# EAGLE design V1 (EAGLE 9.2.2)
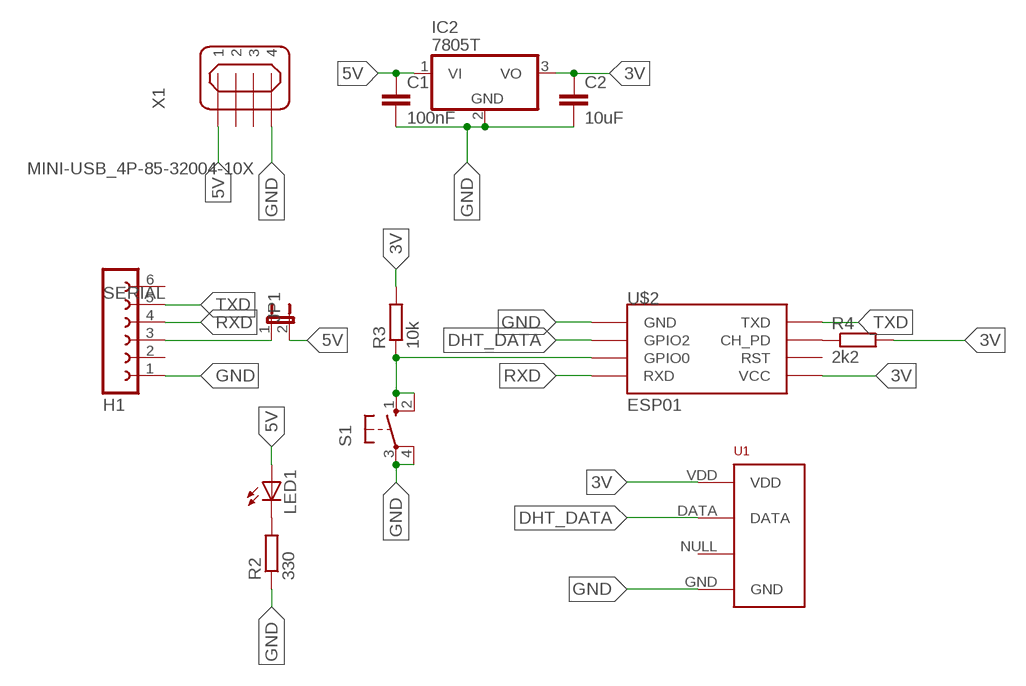
[diagram p0: schematic, sheet 1]

## Parts
C1  100nF  C-EU025-030X050  [C025-030X050]
C2  10uF  C-EU025-030X050  [C025-030X050]
IC2  7805T  [TO220H]
JP1  JP1E  [JP1]
LED1  LED5MM  [LED5MM]
R2  330  R-EU_0207/10  [0207/10]
R3  10k  R-EU_0207/10  [0207/10]
R4  2k2  R-EU_0207/10  [0207/10]
S1  10-XX  [B3F-10XX]
SERIAL  H1  FE06-1  [FE06]
U1  RHT03_DHT-22_AM2302  [RHT03_DHT-22]
U$2  ESP01  [ESP01]
X1  MINI-USB_4P-85-32004-10X  [85-32004-10X]

## Nets
3V: C2.1 IC2.3(VO) R3.2 R4.2 U1.VDD U$2.VCC
5V: C1.1 IC2.1(VI) JP1.2 LED1.A X1.1
DHT_DATA: U1.DATA U$2.GPIO2
GND: C1.2 C2.2 IC2.2(GND) R2.1 S1.3(P) S1.4(P1) SERIAL.1 U1.GND U$2.GND X1.4
N$1: JP1.1 SERIAL.3
N$2: LED1.K(C) R2.2
N$3: R3.1 S1.1(S) S1.2(S1) U$2.GPIO0
N$4: R4.1 U$2.CH_PD
RXD: SERIAL.4 U$2.RX(RXD)
TXD: SERIAL.5 U$2.TX(TXD)
Unconnected: SERIAL.2 SERIAL.6 U1.NULL U$2.RST X1.2 X1.3

## Library data of the parts
C1 C2 = rcl:C-EU: CAPACITOR, European symbol; SPICEPREFIX: C
IC2 = linear:78*: Positive VOLTAGE REGULATOR Source: http://cache.national.com/ds/LM/LM78L05.pdf http://www.fairchildsemi.com/ds/LM/LM7805.pdf
JP1 = jumper:JP1E: JUMPER
LED1 = led:LED: LED OSRAM: - CHIPLED LG R971, LG N971, LY N971, LG Q971, LY Q971, LO R971, LY R971 LH N974, LH R974 LS Q976, LO Q976, LY Q976 LO Q996 - Hyper CHIPLED LW Q18S LB Q993, LB Q99A, LB R99A - SideLED LS A670, LO A670, LY A670, LG A670, LP A670 LB A673, LV A673, LT A673, LW A673 LH A674 LY A675 LS A676, LA A676, LO A676, LY A676, LW A676 LS A679, LY A679, LG A679 - Hyper Micro SIDELED® LS Y876, LA Y876, LO Y876, LY Y876 LT Y87S - SmartLED LW L88C, LW L88S LB L89C, LB L89S, LG L890 LS L89K, LO L89K, LY L89K LS L896, LA L896, LO L896, LY L896 - TOPLED LS T670, LO T670, LY T670, LG T670, LP T670 LSG T670, LSP T670, LSY T670, LOP T670, LYG T670 LG T671, LOG T671, LSG T671 LB T673, LV T673, LT T673, LW T673 LH T674 LS T676, LA T676, LO T676, LY T676, LB T676, LH T676, LSB T676, LW T676 LB T67C, LV T67C, LT T67C, LS T67K, LO T67K, LY T67K, LW E67C LS E67B, LA E67B, LO E67B, LY E67B, LB E67C, LV E67C, LT E67C LW T67C LS T679, LY T679, LG T679 LS T770, LO T770, LY T770, LG T770, LP T770 LB T773, LV T773, LT T773, LW T773 LH T774 LS E675, LA E675, LY E675, LS T675 LS T776, LA T776, LO T776, LY T776, LB T776 LHGB T686 LT T68C, LB T68C - Hyper Mini TOPLED® LB M676 - Mini TOPLED Santana® LG M470 LS M47K, LO M47K, LY M47K Source: http://www.osram.convergy.de LUXEON: - LUMILED® LXK2-PW12-R00, LXK2-PW12-S00, LXK2-PW14-U00, LXK2-PW14-V00 LXK2-PM12-R00, LXK2-PM12-S00, LXK2-PM14-U00 LXK2-PE12-Q00, LXK2-PE12-R00, LXK2-PE12-S00, LXK2-PE14-T00, LXK2-PE14-U00 LXK2-PB12-K00, LXK2-PB12-L00, LXK2-PB12-M00, LXK2-PB14-N00, LXK2-PB14-P00, LXK2-PB14-Q00 LXK2-PR12-L00, LXK2-PR12-M00, LXK2-PR14-Q00, LXK2-PR14-R00 LXK2-PD12-Q00, LXK2-PD12-R00, LXK2-PD12-S00 LXK2-PH12-R00, LXK2-PH12-S00 LXK2-PL12-P00, LXK2-PL12-Q00, LXK2-PL12-R00 Source: www.luxeon.com KINGBRIGHT: KA-3528ASYC Source: www.kingbright.com
R2-R4 = rcl:R-EU_: RESISTOR, European symbol; SPICEPREFIX: R
S1 = switch-omron:10-XX: OMRON SWITCH; MPN: B3F-1000; OC_FARNELL: 176432; OC_NEWARK: 36M3542
SERIAL = con-lsta:FE06-1: FEMALE HEADER; OC_FARNELL: unknown; OC_NEWARK: unknown
U1 = RHT03_DHT-22_AM2302:RHT03_DHT-22_AM2302: RHT03 / DHT-22 / AM2302 Packages and symbol for the RHT03 / DHT-22 relative humidity and temperature sensor. Note: The AM2302 is a wired version of the DHT-22 which typically requires less clearance and is thus provided as a separate package.; PROD_ID: SEN-10167
U$2 = esp8266modules:ESP01: ESP8266 Wifi module 01
X1 = con-cypressindustries:MINI-USB_4P-: MINI USB 4 Pol. Source: www.cypressindustries.com; OC_FARNELL: unknown; OC_NEWARK: unknown

## Board
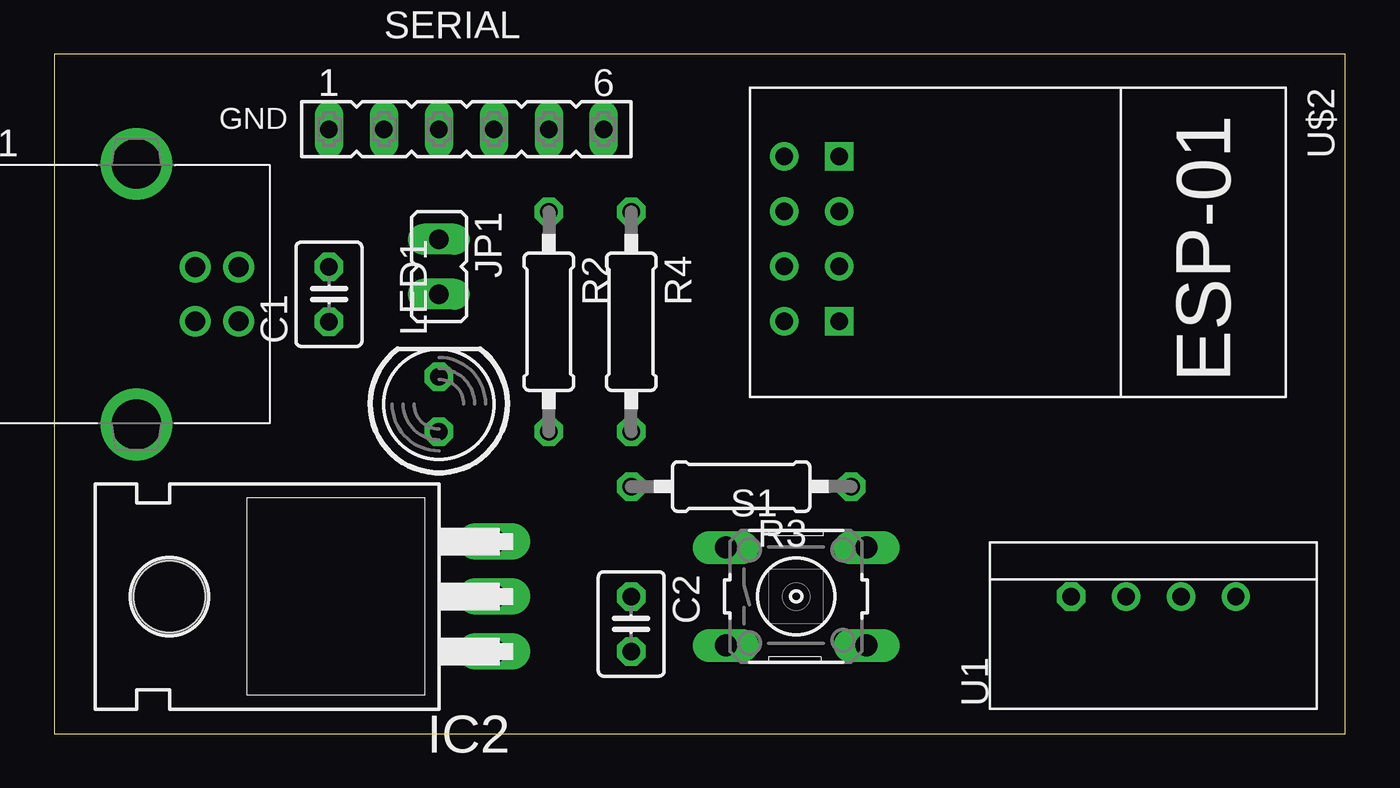
[diagram p1: board, top side]
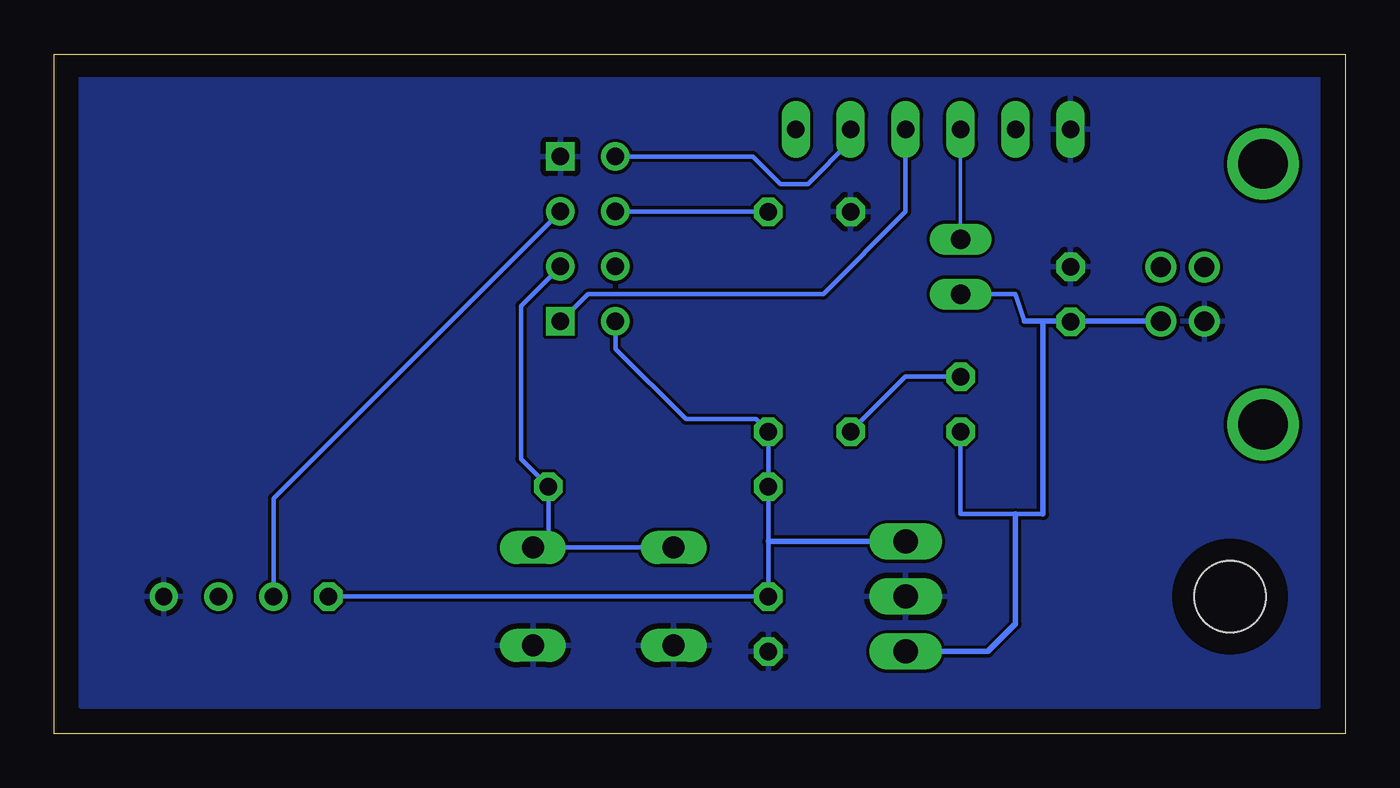
[diagram p2: board, bottom side, seen from below]

Size 59.67 x 31.42 mm. Coordinates in mm from the lower left corner, seen from the top.
Outline: 0,0 59.67,0 59.67,31.42 0,31.42 0,0
Copper layers (1*16): Top 0.035mm / dielectric 1.5mm / Bottom 0.035mm
Design rules "default": minimum track width 6mil, minimum drill 0.35mm, track to track 6mil, track to pad 6mil, pad to pad 6mil, via to via 6mil, smd to smd 6mil, copper to edge 40mil, drill to drill 6mil, minimum pad ring 10mil, minimum via ring 8mil, stop-mask expansion 4mil, vias tented up to drill 0mil, thermal gap 10mil

### Footprints (pad centres in the part's own frame; a part is rotated, then mirrored left to right if it is on the bottom)
C025-030X050 = drill 0.813 octagon: 1 -1.27,0; 2 1.27,0
TO220H = drill 1.118 long: 1 -2.54,-10.16; 2 0,-10.16; 3 2.54,-10.16 | hole 3.302: 0,4.826
JP1 = drill 0.914 long: 1 0,-1.27; 2 0,1.27
LED5MM = drill 0.813 octagon: A -1.27,0; K 1.27,0
0207/10 = drill 0.813 octagon: 1 -5.08,0; 2 5.08,0
B3F-10XX = drill 1.016 long: 1 -3.251,2.261; 2 3.251,2.261; 3 -3.251,-2.261; 4 3.251,-2.261
FE06 = drill 0.813 long: 1 -6.35,0; 2 -3.81,0; 3 -1.27,0; 4 1.27,0; 5 3.81,0; 6 6.35,0
RHT03_DHT-22 = drill 0.8: DATA -1.27,0; GND 3.81,0; NULL 1.27,0 | drill 0.8 octagon: VDD -3.81,0
ESP01 = drill 0.8: CH_PD -1.285,-8.178; GPIO0 1.255,-5.638; GPIO2 -1.285,-5.638; RST 1.255,-8.178; TX -3.825,-8.178; VCC 3.795,-8.178 | drill 0.8 square: GND -3.825,-5.638; RX 3.795,-5.638
85-32004-10X = drill 0.92 pad 1.27: 1 4.71,-1.25; 2 4.71,1.25; 3 2.71,1.25; 4 2.71,-1.25 | drill 2.3 pad 3: M1 0,6.02; M2 0,-6.02

### Placement (x,y rotation side)
C1  12.7,20.32 90 top
C2  26.67,5.08 270 top
IC2  10.16,6.35 90 top
JP1  17.78,21.59 180 top
LED1  17.78,15.24 90 top
R2  22.86,19.05 270 top
R3  31.75,11.43 180 top
R4  26.67,19.05 270 top
S1  34.29,6.35 0 top
SERIAL  19.05,27.94 0 top
U1  50.8,6.35 0 top
U$2  41.91,22.86 270 top
X1  3.81,20.32 0 top

### Tracks (layer width: path | path; a pad name or v marks a point on that pad's centre or on a via)
3V
  Bottom 0.203: U$2.VCC 33.73,17.8 30.48,14.54 27.24,14.54 R4.2 R3.2 26.67,8.89 C2.1 U1.VDD
  Bottom 0.254: IC2.3 26.67,8.89
5V
  Bottom 0.203: 13.97,10.16 15.24,10.16 17.78,10.16 LED1.A | JP1.2 15.24,20.32 14.82,19.07 | C1.1 12.7,19.07
  Bottom 0.254: 14.82,19.07 13.97,19.07 | 13.97,19.07 12.7,19.07 X1.1 | 13.97,10.16 13.97,19.07 | IC2.1 16.51,3.81 15.24,5.08 15.24,10.16
DHT_DATA
  Bottom 0.203: U1.DATA 49.53,10.89 U$2.GPIO2
GND
  pour Bottom: 1.27,30.48 1.27,1.27 58.42,1.27 58.42,30.48
N$1
  Bottom 0.152: SERIAL.3 JP1.1
N$2
  Bottom 0.203: LED1.K 20.32,16.51 R2.2
N$3
  Bottom 0.203: S1.1 36.83,8.61 | S1.2 36.83,8.61 | U$2.GPIO0 38.1,19.78 38.1,12.7 R3.1 36.83,8.61
N$4
  Bottom 0.203: R4.1 33.72,24.13 U$2.CH_PD
RXD
  Bottom 0.203: U$2.RX 35,20.32 24.13,20.32 20.32,24.13 SERIAL.4
TXD
  Bottom 0.203: SERIAL.5 22.86,27.4 24.84,25.42 26.11,25.42 27.38,26.69 U$2.TX

### Text on the board
tNames: GND